# EAGLE design ZATINO 2020 (EAGLE 9.5.2)
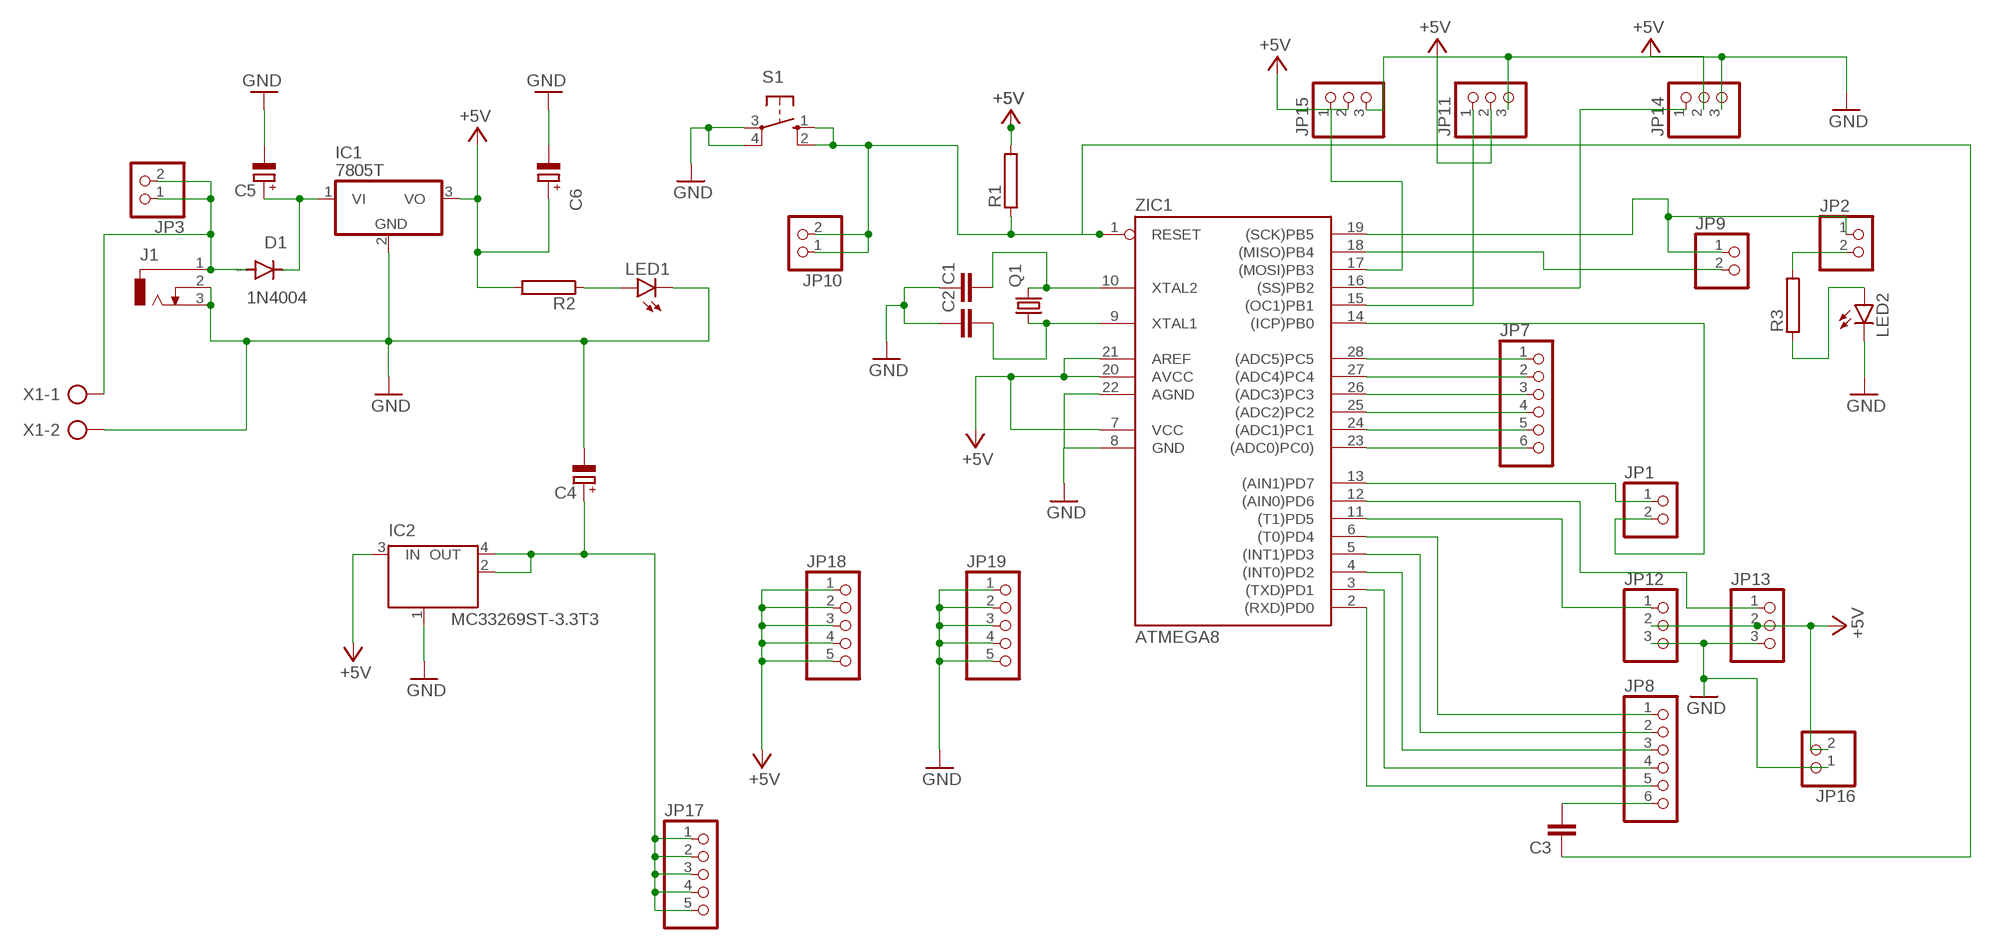
[diagram p0: schematic, sheet 1]

## Parts
C1  C2.5/2  [C2.5-2]
C2  C2.5/2  [C2.5-2]
C3  C2,5-3  [C2.5-3]
C4  CPOL-EUE2,5-6E  [E2,5-6E]
C5  CPOL-EUE2,5-6E  [E2,5-6E]
C6  CPOL-EUE2,5-6E  [E2,5-6E]
D1  1N4004  [DO41-10]
IC1  7805T  [TO220H]
IC2  MC33269ST-3.3T3  [SOT223]
J1  DCJ0303  [DCJ0303]
JP1  PINHD-1X2  [1X02]
JP2  PINHD-1X2  [1X02]
JP3  PINHD-1X2  [1X02]
JP7  PINHD-1X6  [1X06]
JP8  PINHD-1X6  [1X06]
JP9  PINHD-1X2  [1X02]
JP10  PINHD-1X2  [1X02]
JP11  PINHD-1X3  [1X03]
JP12  PINHD-1X3  [1X03]
JP13  PINHD-1X3  [1X03]
JP14  PINHD-1X3  [1X03]
JP15  PINHD-1X3  [1X03]
JP16  PINHD-1X2  [1X02]
JP17  PINHD-1X5  [1X05]
JP18  PINHD-1X5  [1X05]
JP19  PINHD-1X5  [1X05]
LED1  LED5MM  [LED5MM]
LED2  LED5MM  [LED5MM]
Q1  CRYSTALHC49U-V  [HC49U-V]
R1  RRS1/4  [RS1/4]
R2  RRS1/4  [RS1/4]
R3  RRS1/4  [RS1/4]
S1  10-XX  [B3F-10XX]
X1  AK300/2  [AK300/2]
ZIC1  ATMEGA8  AT90S4433P  [DIL28-3]

## Nets
+5V: C6.+ IC1.3(VO) IC2.3(IN) JP11.2 JP12.2 JP13.2 JP14.2 JP15.2 JP16.2 JP18.1 JP18.2 JP18.3 JP18.4 JP18.5 R1.2 R2.2 ZIC1.7(VCC) ZIC1.20(AVCC) ZIC1.21(AREF)
GND: C1.1 C2.1 C4.- C5.- C6.- IC1.2(GND) IC2.1(GND/ADJ) J1.2 J1.3 JP11.3 JP12.3 JP13.3 JP14.3 JP15.3 JP16.1 JP19.1 JP19.2 JP19.3 JP19.4 JP19.5 LED1.K(C) LED2.K(C) S1.3(P) S1.4(P1) X1.2 ZIC1.8(GND) ZIC1.22(AGND)
N$1: JP7.1 ZIC1.28((ADC5)PC5)
N$2: JP7.2 ZIC1.27((ADC4)PC4)
N$3: JP7.3 ZIC1.26((ADC3)PC3)
N$4: JP7.4 ZIC1.25((ADC2)PC2)
N$5: JP7.5 ZIC1.24((ADC1)PC1)
N$6: JP7.6 ZIC1.23((ADC0)PC0))
N$7: JP1.1 ZIC1.13((AIN1)PD7)
N$8: JP2.1 JP9.1 ZIC1.19((SCK)PB5)
N$9: JP12.1 ZIC1.11((T1)PD5)
N$10: C3.1 JP10.1 JP10.2 R1.1 S1.1(S) S1.2(S1) ZIC1.1(RESET)
N$11: JP9.2 ZIC1.18((MISO)PB4)
N$12: JP13.1 ZIC1.12((AIN0)PD6)
N$13: JP2.2 R3.2
N$14: JP15.1 ZIC1.17((MOSI)PB3)
N$15: JP14.1 ZIC1.16((SS)PB2)
N$16: JP11.1 ZIC1.15((OC1)PB1)
N$17: JP1.2 ZIC1.14((ICP)PB0)
N$18: JP8.5 ZIC1.2((RXD)PD0)
N$19: JP8.4 ZIC1.3((TXD)PD1)
N$20: JP8.3 ZIC1.4((INT0)PD2)
N$21: JP8.2 ZIC1.5((INT1)PD3)
N$22: JP8.1 ZIC1.6((T0)PD4)
N$23: LED2.A R3.1
N$24: C3.2 JP8.6
N$25: C2.2 Q1.1 ZIC1.9(XTAL1)
N$28: C1.2 Q1.2 ZIC1.10(XTAL2)
N$29: C4.+ IC2.2(OUT) IC2.4(OUT) JP17.1 JP17.2 JP17.3 JP17.4 JP17.5
N$30: C5.+ D1.C IC1.1(VI)
N$32: LED1.A R2.1
N$33: D1.A J1.1 JP3.1 JP3.2 X1.1

## Library data of the parts
C1-C3 = capacitor-wima:C: CAPACITOR naming: grid - package width
C4-C6 = rcl:CPOL-EU: POLARIZED CAPACITOR, European symbol; SPICEPREFIX: C
D1 = diode:1N4004: DIODE general purpose rectifier, 1 A
IC1 = linear:78*: Positive VOLTAGE REGULATOR Source: http://cache.national.com/ds/LM/LM78L05.pdf http://www.fairchildsemi.com/ds/LM/LM7805.pdf
IC2 = linear:MC33269ST*: Adjustable Output Low Dropout Voltage Regulator 800 mA Source: http://www.onsemi.com/pub/Collateral/MC33269-D.PDF
J1 = con-jack:DCJ0303: DC POWER JACK Source: DCJ0303.pdf; OC_FARNELL: unknown; OC_NEWARK: unknown
JP1-JP3 JP9 JP10 JP16 = pinhead:PINHD-1X2: PIN HEADER
JP7 JP8 = pinhead:PINHD-1X6: PIN HEADER
JP11-JP15 = pinhead:PINHD-1X3: PIN HEADER
JP17-JP19 = pinhead:PINHD-1X5: PIN HEADER
LED1 LED2 = led:LED: LED OSRAM: - CHIPLED LG R971, LG N971, LY N971, LG Q971, LY Q971, LO R971, LY R971 LH N974, LH R974 LS Q976, LO Q976, LY Q976 LO Q996 - Hyper CHIPLED LW Q18S LB Q993, LB Q99A, LB R99A - SideLED LS A670, LO A670, LY A670, LG A670, LP A670 LB A673, LV A673, LT A673, LW A673 LH A674 LY A675 LS A676, LA A676, LO A676, LY A676, LW A676 LS A679, LY A679, LG A679 - Hyper Micro SIDELED® LS Y876, LA Y876, LO Y876, LY Y876 LT Y87S - SmartLED LW L88C, LW L88S LB L89C, LB L89S, LG L890 LS L89K, LO L89K, LY L89K LS L896, LA L896, LO L896, LY L896 - TOPLED LS T670, LO T670, LY T670, LG T670, LP T670 LSG T670, LSP T670, LSY T670, LOP T670, LYG T670 LG T671, LOG T671, LSG T671 LB T673, LV T673, LT T673, LW T673 LH T674 LS T676, LA T676, LO T676, LY T676, LB T676, LH T676, LSB T676, LW T676 LB T67C, LV T67C, LT T67C, LS T67K, LO T67K, LY T67K, LW E67C LS E67B, LA E67B, LO E67B, LY E67B, LB E67C, LV E67C, LT E67C LW T67C LS T679, LY T679, LG T679 LS T770, LO T770, LY T770, LG T770, LP T770 LB T773, LV T773, LT T773, LW T773 LH T774 LS E675, LA E675, LY E675, LS T675 LS T776, LA T776, LO T776, LY T776, LB T776 LHGB T686 LT T68C, LB T68C - Hyper Mini TOPLED® LB M676 - Mini TOPLED Santana® LG M470 LS M47K, LO M47K, LY M47K Source: http://www.osram.convergy.de LUXEON: - LUMILED® LXK2-PW12-R00, LXK2-PW12-S00, LXK2-PW14-U00, LXK2-PW14-V00 LXK2-PM12-R00, LXK2-PM12-S00, LXK2-PM14-U00 LXK2-PE12-Q00, LXK2-PE12-R00, LXK2-PE12-S00, LXK2-PE14-T00, LXK2-PE14-U00 LXK2-PB12-K00, LXK2-PB12-L00, LXK2-PB12-M00, LXK2-PB14-N00, LXK2-PB14-P00, LXK2-PB14-Q00 LXK2-PR12-L00, LXK2-PR12-M00, LXK2-PR14-Q00, LXK2-PR14-R00 LXK2-PD12-Q00, LXK2-PD12-R00, LXK2-PD12-S00 LXK2-PH12-R00, LXK2-PH12-S00 LXK2-PL12-P00, LXK2-PL12-Q00, LXK2-PL12-R00 Source: www.luxeon.com KINGBRIGHT: KA-3528ASYC Source: www.kingbright.com
Q1 = crystal:CRYSTAL: CRYSTAL; OC_FARNELL: 1666969; OC_NEWARK: unknown
R1-R3 = resistor-power:R: Power Resitor; MF: OHMITE; MPN: RRS1K0; OC_FARNELL: unknown; OC_NEWARK: 01F7661
S1 = switch-omron:10-XX: OMRON SWITCH; MPN: B3F-1000; OC_FARNELL: 176432; OC_NEWARK: 36M3542
X1 = con-ptr500:AK300/2: CONNECTOR; OC_FARNELL: unknown; OC_NEWARK: unknown
ZIC1 = atmel:AT90S4433: MICROCONTROLLER 4 Kbytes FLASH 128 bytes SRAM 256 bytes EEPROM UART 6-channel 10 bit ADC

## Board
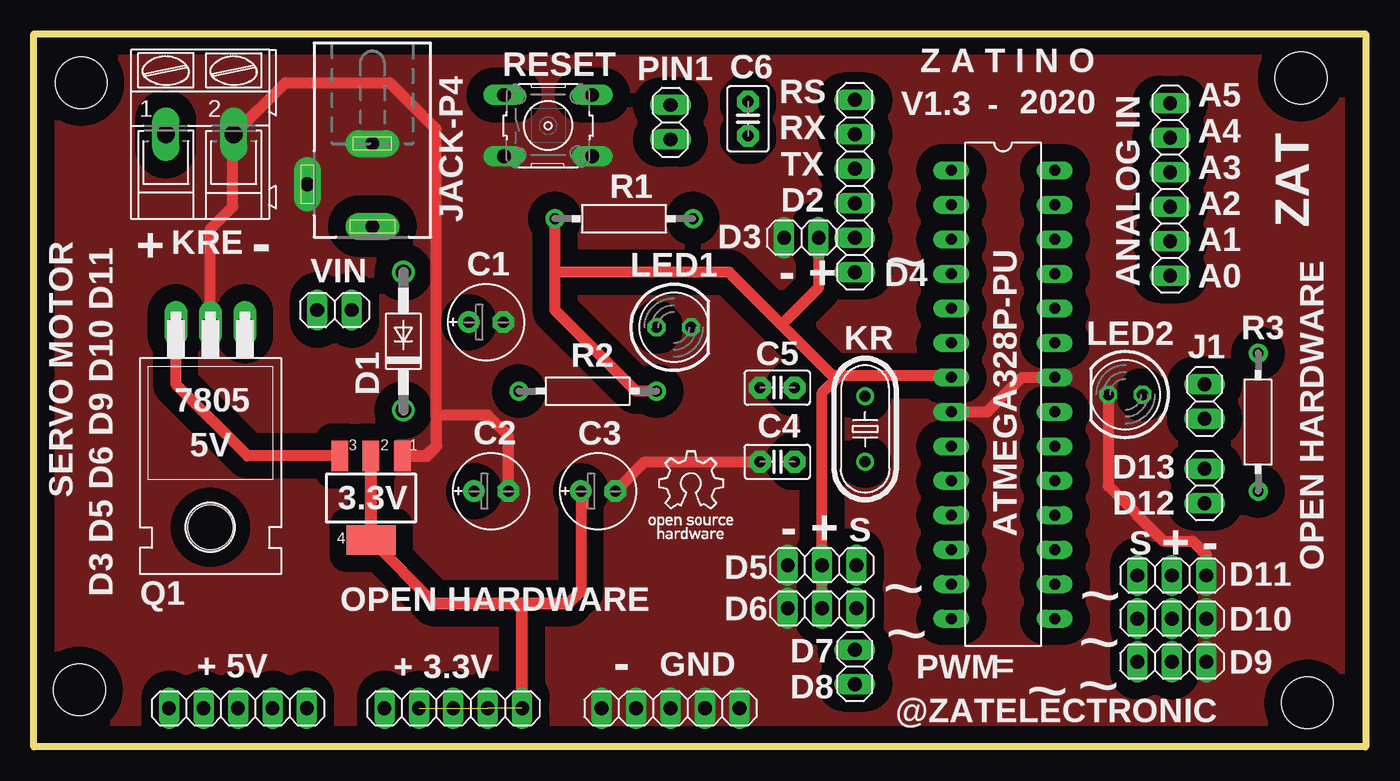
[diagram p1: board, top side]
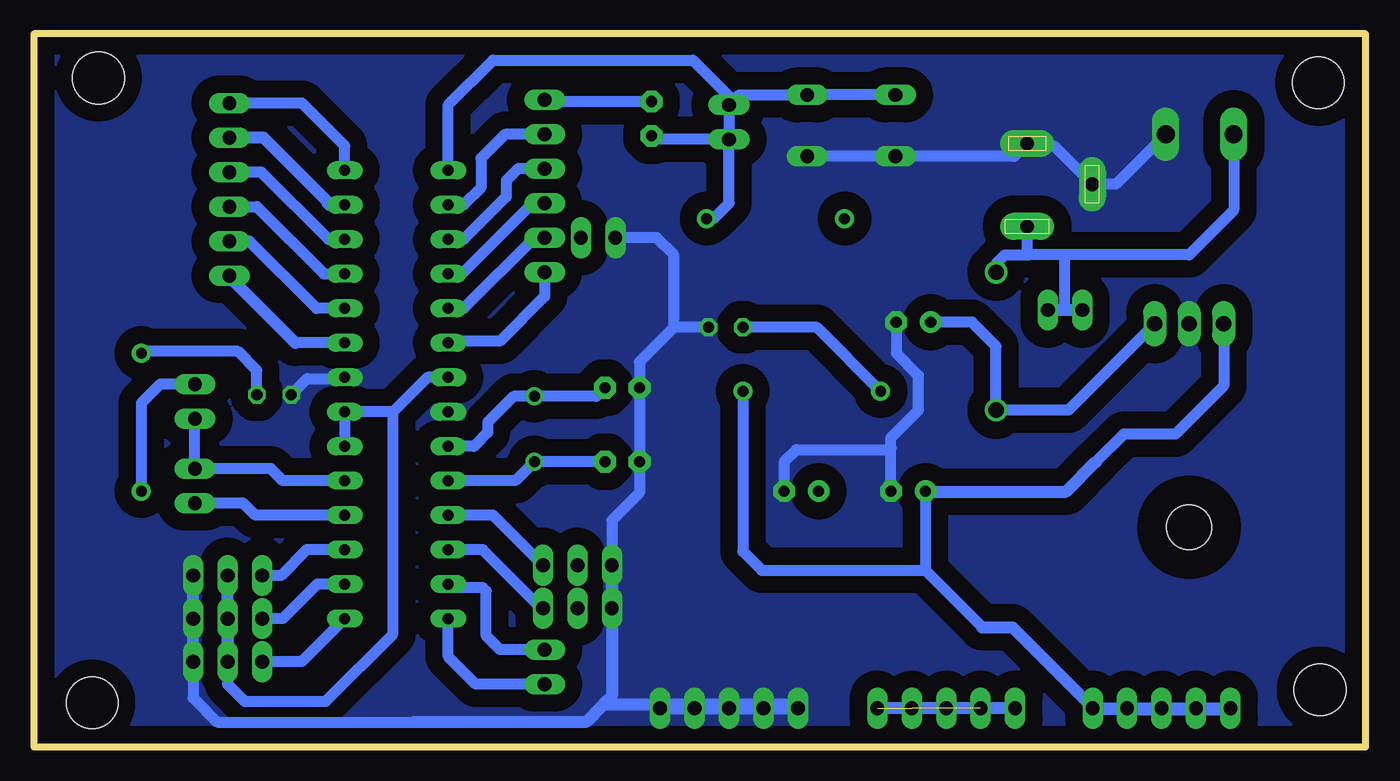
[diagram p2: board, bottom side, seen from below]

Size 98.15 x 52.53 mm. Coordinates in mm from the lower left corner, seen from the top.
Outline: 0,52.53 98.15,52.53 98.15,0 0,0 0,52.53
Copper layers (1*16): Top 0.035mm / dielectric 1.5mm / Bottom 0.035mm
Design rules "default *": minimum track width 35mil, minimum drill 0.35mm, track to track 6mil, track to pad 6mil, pad to pad 6mil, via to via 6mil, smd to smd 6mil, copper to edge 40mil, drill to drill 6mil, minimum pad ring 10mil, minimum via ring 8mil, stop-mask expansion 4mil, vias tented up to drill 0mil, thermal gap 10mil
Holes 3.81 mm at 3.47,48.93 93.39,49.28 3.36,4.19 93.86,3.25

### Footprints (pad centres in the part's own frame; a part is rotated, then mirrored left to right if it is on the bottom)
C2.5-2 = drill 0.813 pad 1.6 octagon: 1 -1.27,0; 2 1.27,0
C2.5-3 = drill 0.813 pad 1.6 octagon: 1 -1.27,0; 2 1.27,0
E2,5-6E = drill 0.813 pad 1.575: + -1.27,0 | drill 0.813 pad 1.575 octagon: - 1.27,0
DO41-10 = drill 1.118: A 5.08,0; C -5.08,0
TO220H = drill 1.118 long: 1 -2.54,-10.16; 2 0,-10.16; 3 2.54,-10.16 | hole 3.302: 0,4.826
SOT223 = smd 1.219 x 2.235: 1 -2.311,-3.099; 2 0,-3.099; 3 2.311,-3.099 | smd 3.6 x 2.2: 4 0,3.099
DCJ0303 = drill 1 pad 2 long: 1 0,3.1; 2 4.8,0; 3 0,-3
1X02 = drill 1.016 long: 1 -1.27,0; 2 1.27,0
1X06 = drill 1.016 long: 1 -6.35,0; 2 -3.81,0; 3 -1.27,0; 4 1.27,0; 5 3.81,0; 6 6.35,0
1X03 = drill 1.016 long: 1 -2.54,0; 2 0,0; 3 2.54,0
1X05 = drill 1.016 long: 1 -5.08,0; 2 -2.54,0; 3 0,0; 4 2.54,0; 5 5.08,0
LED5MM = drill 0.813 octagon: A -1.27,0; K 1.27,0
HC49U-V = drill 0.813: 1 -2.413,0; 2 2.413,0
RS1/4 = drill 0.8 pad 1.4: 1 -5.08,0; 2 5.08,0
B3F-10XX = drill 1.016 long: 1 -3.251,2.261; 2 3.251,2.261; 3 -3.251,-2.261; 4 3.251,-2.261
AK300/2 = drill 1.321 long: 1 -2.515,0; 2 2.489,0
DIL28-3 = drill 0.813 long: 1 -16.51,-3.81; 2 -13.97,-3.81; 3 -11.43,-3.81; 4 -8.89,-3.81; 5 -6.35,-3.81; 6 -3.81,-3.81; 7 -1.27,-3.81; 8 1.27,-3.81; 9 3.81,-3.81; 10 6.35,-3.81; 11 8.89,-3.81; 12 11.43,-3.81; 13 13.97,-3.81; 14 16.51,-3.81; 15 16.51,3.81; 16 13.97,3.81; 17 11.43,3.81; 18 8.89,3.81; 19 6.35,3.81; 20 3.81,3.81; 21 1.27,3.81; 22 -1.27,3.81; 23 -3.81,3.81; 24 -6.35,3.81; 25 -8.89,3.81; 26 -11.43,3.81; 27 -13.97,3.81; 28 -16.51,3.81

### Placement (x,y rotation side)
C1  54.79,21.01 0 top
C2  54.79,26.47 0 top
C3  52.63,46.28 90 top
C4  41.58,18.85 0 top
C5  33.32,31.29 0 top
C6  33.71,18.85 0 top
D1  27.23,29.9 90 top
IC1  13,21.01 180 top
IC2  24.85,18.34 180 top
J1  24.94,41.45 180 top
JP1  60.5,5.89 270 top
JP2  86.28,25.45 90 top
JP3  22.15,32.18 0 top
JP7  83.74,41.07 270 top
JP8  60.5,41.33 90 top
JP9  86.28,19.23 270 top
JP10  46.91,46.02 90 top
JP11  83.87,6.27 0 top
JP12  58.09,13.39 180 top
JP13  58.09,10.21 180 top
JP14  83.87,9.45 0 top
JP15  83.87,12.62 0 top
JP16  56.57,37.52 0 top
JP17  30.91,2.84 0 top
JP18  15.04,2.84 0 top
JP19  46.91,2.84 0 top
LED1  47.17,30.91 0 top
LED2  80.44,25.96 180 top
Q1  61.26,23.42 270 top
R1  43.48,38.91 180 top
R2  40.82,26.21 0 top
R3  90.22,23.93 270 top
S1  37.9,45.77 0 top
X1  12.24,45.14 0 top
ZIC1  71.42,25.96 270 top

### Tracks (layer width: path | path; a pad name or v marks a point on that pad's centre or on a via)
+5V
  Top 0.152: 22.66,21.44 IC2.3 | 45.14,26.21 R2.2 46.28,26.21 | 57.71,37.49 JP16.2
  Top 0.813: JP13.2 JP12.2 58.09,26.09 59.36,27.36 | 59.36,27.36 67.49,27.36 ZIC1.7 | R2.2 44.37,26.21 38.4,32.18 38.4,34.85 | 38.4,34.85 R1.2 | 59.36,27.36 58.85,27.36 55.1,31.1 | 55.1,31.1 51.23,34.98 38.53,34.98 38.4,34.85 | IC2.3 15.74,21.44 10.46,26.72 IC1.3 | JP16.2 57.84,33.83 55.1,31.1
  Bottom 0.152: 45.85,26.21 R2.2 46,26.21
  Bottom 0.813: ZIC1.7 69.14,27.23 71.68,24.69 | 71.68,24.69 ZIC1.21 ZIC1.20 | JP15.2 JP14.2 83.87,9.19 | JP11.2 83.87,4.62 82.6,3.35 76.63,3.35 71.68,8.31 71.68,24.69 | C6.+ 32.44,13 | 32.44,13 28.24,8.81 | R2.2 45.9,14.4 44.5,13 32.44,13 | IC1.3 10.46,26.59 14.02,23.04 17.83,23.04 19.86,21.01
  Bottom 0.889: JP18.5 19.99,2.78 17.77,2.78 JP18.4 17.45,2.78 15.23,2.78 JP18.3 14.59,2.78 12.69,2.78 JP18.2 12.37,2.78 10.15,2.78 JP18.1 JP18.5 | 28.24,8.81 26.02,8.81 20.31,3.1 JP18.5 | 19.86,21.01 22.05,18.81 32.4,18.81 C6.+ | JP14.2 JP11.2 JP15.2
GND
  Top 0.152: 27.12,21.4 IC2.1 | X1.2 14.88,44.81 14.66,44.5
  Top 0.813: ZIC1.8 70.28,24.69 72.82,27.23 ZIC1.22 | LED2.K 79.17,19.23 83.24,15.16 85.39,15.16 86.41,14.15 JP15.3 | IC1.2 13,38.15 14.66,39.8 14.66,44.5 | C4.- 45.01,21.01 C1.1 | X1.2 18.54,48.95 26.21,48.95 29.64,45.52 29.64,24.31 29.66,24.33 | 29.66,22.2 29.66,24.33 | C6.- 34.98,22.91 33.45,24.43 29.77,24.43 29.66,24.33
  Top 0.889: IC2.1 28.91,21.44 29.66,22.2
  Bottom 0.152: 75.23,27.13 ZIC1.22 | 53.62,21.01 C1.1 | 55.27,37.49 JP16.1 | 51.16,31.24 50.98,30.91
  Bottom 0.813: S1.4 S1.3 25.89,43.51 25.11,44.29 | LED2.K 78,27.13 75.23,27.13 | JP11.3 86.41,3.61 84.63,1.83 70.15,1.83 70.03,1.83 | 53.62,21.01 53.52,21.11 C2.1 53.52,28.37 50.98,30.91 | C1.1 53.52,18.72 55.55,16.69 55.55,13.97 JP12.3 | 55.55,9.45 JP13.3 | LED1.K 50.98,30.91 | J1.3 25.11,44.29 | J1.2 22.98,44.29 25.11,44.29 | X1.2 18.41,41.45 J1.2 | J1.2 20.37,41.45 | C5.- 34.59,29.01 32.94,27.36 32.94,24.82 34.98,22.78 34.98,22.02 | C4.- 42.85,21.01 41.96,21.89 35.1,21.89 34.98,22.02 | C6.- 34.98,22.02 | 50.98,30.91 50.98,36.25 52.25,37.52 JP16.1
  Bottom 0.889: JP13.3 55.55,3.73 56.18,3.1 | 56.18,3.1 57.45,1.83 70.15,1.83 | 52.25,3.1 JP19.5 49.26,2.84 49.2,2.78 JP19.4 46.72,2.84 46.66,2.78 JP19.3 JP19.2 JP19.1 42.09,3.1 52.25,3.1 | 52.25,3.1 56.18,3.1 | JP12.3 JP13.3 | JP13.3 55.55,13.97 | JP11.3 JP15.3
  pour Bottom (isolate 1.27, no thermals): -0.09,0.02 -0.09,52.4 98.15,52.4 98.15,-0.05
  pour Top (isolate 1.27, no thermals): -0.05,52.5 98.09,52.5 98.09,-0.13 -0.05,-0.13 -0.05,52.43
N$1
  Bottom 0.152: 75.23,42.98 ZIC1.28
  Bottom 0.813: ZIC1.28 75.23,44.27 78.38,47.42 JP7.1
N$2
  Bottom 0.813: ZIC1.27 76.35,39.93
  Bottom 0.889: 76.35,39.93 76.5,40.08 76.5,40.16 81.23,44.88 JP7.2
N$3
  Bottom 0.152: 75.23,37.64 ZIC1.26 | 83.49,42.09 JP7.3
  Bottom 0.813: ZIC1.26 76.43,37.39 81.38,42.34 JP7.3
N$4
  Bottom 0.813: JP7.4 81.71,39.8 76.76,34.85 ZIC1.25
N$5
  Bottom 0.813: ZIC1.24 77.32,32.31 82.27,37.26 JP7.5
N$6
  Bottom 0.152: 75.23,30.02 ZIC1.23
  Bottom 0.813: ZIC1.23 78.89,29.77
  Bottom 0.889: 78.89,29.77 83.79,34.67 JP7.6
N$7
  Bottom 0.152: 67.61,11.73 ZIC1.13
  Bottom 0.813: JP1.1 63.8,7.16 64.82,8.18 64.82,11.48 65.07,11.73 67.61,11.73
N$8
  Bottom 0.813: ZIC1.19 79.81,19.61 80.7,20.5 JP9.1 JP2.1
N$9
  Bottom 0.813: JP12.1 64.31,17.07 ZIC1.11
N$10
  Bottom 0.152: 67.61,42.52 ZIC1.1 67.61,42.98 | 52.73,45.01 C3.1
  Bottom 0.813: S1.1 S1.2 46.18,48.03 JP10.2 | JP10.2 JP10.1 | JP10.1 52.37,44.75 C3.1 | ZIC1.1 67.61,47.29 64.31,50.6 49.58,50.6 46.15,47.17 46.79,47.17 JP10.2 | R1.1 48.06,38.91 46.91,40.06 JP10.1
N$11
  Bottom 0.813: ZIC1.18 81.84,17.07 82.73,17.96 JP9.2
N$12
  Bottom 0.152: 67.61,14.02 ZIC1.12 | 61.01,10.46 JP13.1
  Bottom 0.813: JP13.1 60.76,10.21 65.07,14.53 ZIC1.12
N$13
  Bottom 0.813: JP2.2 88.82,26.72 90.22,25.32 R3.2
N$14
  Bottom 0.152: 75.23,14.02 ZIC1.17
  Bottom 0.813: ZIC1.17 78.03,14.53 79.93,12.62 JP15.1
N$15
  Bottom 0.152: 75.23,11.73 ZIC1.16
  Bottom 0.813: ZIC1.16 77.27,11.99 79.81,9.45 JP14.1
N$16
  Bottom 0.813: ZIC1.15 78.41,6.27 JP11.1
N$17
  Bottom 0.813: JP1.2 65.58,4.62 67.61,6.65 ZIC1.14
N$18
  Bottom 0.813: JP8.5 63.42,45.14 65.2,43.36 65.2,41.2 66.47,39.93 ZIC1.2
N$19
  Bottom 0.152: 67.61,37.64 ZIC1.3 | 60.76,42.21 JP8.4
  Bottom 0.813: JP8.4 62.46,42.6 63.33,41.72 63.33,40.53 66.47,37.39 ZIC1.3
N$20
  Bottom 0.152: 67.61,35.36 67.61,34.98 ZIC1.4 | 60.76,39.93 JP8.3
  Bottom 0.813: JP8.3 61.39,40.06 66.47,34.98 67.61,34.98
N$21
  Bottom 0.152: 60.76,36.88 JP8.2
  Bottom 0.813: JP8.2 61.26,37.52 66.47,32.31 ZIC1.5
N$22
  Bottom 0.152: 67.61,30.02 67.61,29.9 ZIC1.6 | 60.76,34.59 JP8.1
  Bottom 0.813: JP8.1 60.5,33.2 63.8,29.9 67.61,29.9
N$23
  Bottom 0.813: LED2.A 81.71,27.74 83.11,29.13 90.09,29.13 R3.1
N$24
  Bottom 0.813: C3.2 60.38,47.55 JP8.6
N$25
  Bottom 0.152: 67.61,22.4 ZIC1.9
  Bottom 0.813: ZIC1.9 65.71,22.15 64.69,23.16 64.69,23.93 62.79,25.83 Q1.1 56.69,25.83 C2.2
N$28
  Bottom 0.152: 67.61,20.12 ZIC1.10
  Bottom 0.813: ZIC1.10 62.66,19.61 Q1.2 C1.2
N$29  (3 unrouted)
  Top 0.152: 24.72,15.93 IC2.4
  Top 0.813: 24.62,15.47 IC2.4 29.5,10.59 | C4.+ 40.31,11.48 39.42,10.59
  Top 0.889: 29.5,10.59 36.12,10.59 | 36.12,10.59 39.42,10.59 | JP17.5 35.99,10.46 36.12,10.59 | 24.82,21.42 IC2.2 IC2.4 24.82,15.27
  Bottom 0.889: JP17.1 JP17.5
N$30
  Bottom 0.152: 15.8,30.78 IC1.1 | 27.23,25.45 D1.C
  Bottom 0.813: IC1.1 21.89,24.82 D1.C 27.23,29.51 29.01,31.29 C5.+
N$32
  Bottom 0.813: R2.1 40.44,30.91 LED1.A
N$33
  Bottom 0.152: 23.42,32.31 JP3.2
  Bottom 0.813: X1.1 9.73,39.52 13,36.25 22.15,36.25 | D1.A 27.23,35.61 26.59,36.25 24.82,36.25 | JP3.2 23.14,32.18 22.28,32.18 22.15,32.31 22.15,36.25 | 22.15,36.25 24.82,36.25 | J1.1 24.94,36.37 24.82,36.25
  Bottom 0.889: JP3.1 23.14,32.18

### Text on the board
tNames: Z A T I N O | RESET | PIN1 | C6 | V1.3 | - | 2020 | RS / RX / TX / D2 | R1 | JACK-P4 | ZAT | + | - | D3 | KRE | LED1 | C1 | - | + | VIN | D4 | ~ | ANALOG IN | A5 / A4 / A3 / A2 / A1 / A0 | KR | R3 | C5 | LED2 | R2 | J1 | D1 | ATMEGA328P-PU | 7805 | C4 | C2 | C3 | 5V | SERVO MOTOR | 3.3V | D13 / D12 | - | + | S | S | + | - | OPEN HARDWARE | D5 | D11 | D3 D5 D6 D9 D10 D11 | Q1 | OPEN HARDWARE | ~ | D6 | ~ | D10 | - | D7 / D8 | ~ | ~ | + 5V | + 3.3V | GND | PWM | = | D9 | @ZATELECTRONIC | ~ | ~